# Altium schematic sheet Encoder.SchDoc: Title
size A4; SchTemplateVer: V2.0; Author: Adam Mizerkiewicz; CompanyName: Adam Mizerkiewicz; DrawnBy: Adam Mizerkiewicz; Engineer: Adam Mizerkiewicz; Organization: Adam Mizerkiewicz; Address1: Sarnia 2/19; Address2: 61-058 Poznań; Revision: 0.0
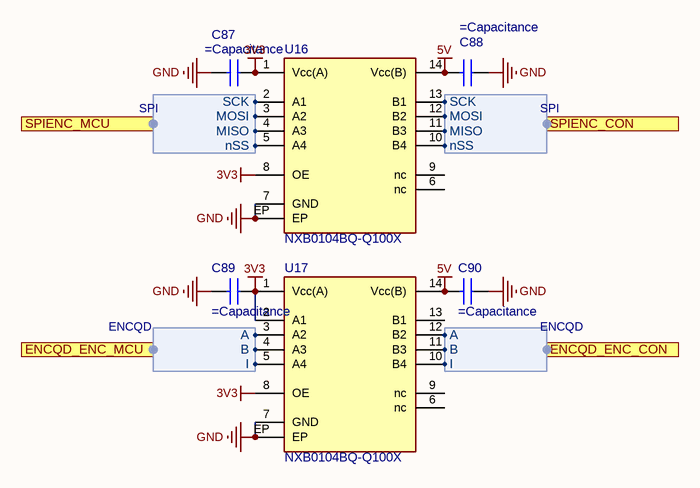
[diagram p0: Encoder.SchDoc]

## Parts
C87  (no value)  [C0402]
C88  (no value)  [C0402]
C89  (no value)  [C0402]
C90  (no value)  [C0402]
U16  NXB0104BQ-Q100X  [DHVQFN14]
U17  NXB0104BQ-Q100X  [DHVQFN14]

## Ports
ENCQD_ENC_CON (harness ENCQD), ENCQD_ENC_MCU (harness ENCQD), SPIENC_CON (harness SPI), SPIENC_MCU (harness SPI)

## Harnesses
SPI: MISO, MOSI, SCK, nSS
ENCQD: B, A, I

## Nets
3V3: C87.1 C89.1 U16.1(Vcc(A)) U16.8(OE) U17.1(Vcc(A)) U17.2(A1) U17.8(OE)
5V: C88.2 C90.2 U16.14(Vcc(B)) U17.14(Vcc(B))
GND: C87.2 C88.1 C89.2 C90.1 U16.7(GND) U16.EP U17.7(GND) U17.EP
NetU16_2: U16.2(A1) ; port SPIENC_MCU.SCK
NetU16_3: U16.3(A2) ; port SPIENC_MCU.MOSI
NetU16_4: U16.4(A3) ; port SPIENC_MCU.MISO
NetU16_5: U16.5(A4) ; port SPIENC_MCU.nSS
NetU16_10: U16.10(B4) ; port SPIENC_CON.nSS
NetU16_11: U16.11(B3) ; port SPIENC_CON.MISO
NetU16_12: U16.12(B2) ; port SPIENC_CON.MOSI
NetU16_13: U16.13(B1) ; port SPIENC_CON.SCK
NetU17_3: U17.3(A2) ; port ENCQD_ENC_MCU.A
NetU17_4: U17.4(A3) ; port ENCQD_ENC_MCU.B
NetU17_5: U17.5(A4) ; port ENCQD_ENC_MCU.I
NetU17_10: U17.10(B4) ; port ENCQD_ENC_CON.I
NetU17_11: U17.11(B3) ; port ENCQD_ENC_CON.B
NetU17_12: U17.12(B2) ; port ENCQD_ENC_CON.A

Not connected (* = marked no-connect by the designer): U16 6(nc) 9(nc); U17 6(nc) 9(nc) 13(B1)

## Notes on the sheet
- Revision
  =Revision
- Sheet
  =SheetNumber / =SheetTotal

## Library data of the parts
C87-C90 = CAP0402-0.1uF-50V: CAP CER 0.1UF 50V X7R 0402; Manufacturer: Walsin Technologies; Manufacturer Part Number: 0402B104K500CT; Capacitance: 100nF; Material: 4241ConductorMaterial; Value: 100nF; Tolerance: 10%; Dielectric: 1511DielectricType; Supplier: Digikey; Supplier Part Number: 1292-1176-1-ND; RoHS: Yes; Category: Ceramic Capacitors; Stock: 109567; Pricing: 1=0,08, 10=0,005, 100=0,0032, 1000=0,0024 (USD); Mounting Technology: Surface Mount; Case/Package: 0402; Case Code (Imperial): 0402; Case Code (Metric): 1005; Min Operating Temperature: -55°C; Max Operating Temperature: 125°C; Packaging: Cut Tape; Voltage Rating: 50V; Series: -; Voltage Rating (DC): 50V; Height: 550um; RoHS Compliant: Yes; Lead Free: 5697LeadFree; ComponentLink1URL: http://datasheet.octopart.com/0402B104K500CT-Walsin-Technologies-datasheet-26371553.pdf?src-supplier=Arrow+Electronics; ComponentLink1Description: http://datasheet.octopart.com/0402B104K500CT-Walsin-Technologies-datasheet-26371553.pdf?src-supplier=Arrow+Electronics; ComponentLink2URL: http://datasheet.octopart.com/0402B104K500CT-Walsin-Technologies-datasheet-26371553.pdf?src-supplier=Verical; ComponentLink2Description: http://datasheet.octopart.com/0402B104K500CT-Walsin-Technologies-datasheet-26371553.pdf?src-supplier=Verical; ComponentLink3URL: http://www.passivecomponent.com/indexsea/0402B104K500CT-IE.pdf?src-supplier=Digikey; ComponentLink3Description: http://www.passivecomponent.com/indexsea/0402B104K500CT-IE.pdf?src-supplier=Digikey; ComponentLink4URL: http://datasheet.octopart.com/0402B104K500CT-Walsin-Technologies-datasheet-26371553.pdf?src-supplier=Rs; ComponentLink4Description: http://datasheet.octopart.com/0402B104K500CT-Walsin-Technologies-datasheet-26371553.pdf?src-supplier=Rs; ComponentLink5URL: https://datasheet.octopart.com/0402B104K500CT-Walsin-Technologies-datasheet-128065749.pdf?src-supplier=Future+Electronics; ComponentLink5Description: https://datasheet.octopart.com/0402B104K500CT-Walsin-Technologies-datasheet-128065749.pdf?src-supplier=Future+Electronics; ComponentLink6URL: http://datasheet.octopart.com/0402B104K500CT-Walsin-Technologies-datasheet-26371553.pdf?src-supplier=Farnell; ComponentLink6Description: http://datasheet.octopart.com/0402B104K500CT-Walsin-Technologies-datasheet-26371553.pdf?src-supplier=Farnell; ComponentLink7URL: http://datasheet.octopart.com/0402B104K500CT-Walsin-Technologies-datasheet-26371553.pdf?src-supplier=Newark; ComponentLink7Description: http://datasheet.octopart.com/0402B104K500CT-Walsin-Technologies-datasheet-26371553.pdf?src-supplier=Newark; ComponentLink8URL: http://datasheet.octopart.com/0402B104K500CT-Walsin-Technologies-datasheet-26371553.pdf?src-supplier=Mouser; ComponentLink8Description: http://datasheet.octopart.com/0402B104K500CT-Walsin-Technologies-datasheet-26371553.pdf?src-supplier=Mouser; ComponentLink9URL: http://datasheet.octopart.com/0402B104K500CT-Walsin-Technologies-datasheet-26371553.pdf?src-supplier=Digikey; ComponentLink9Description: http://datasheet.octopart.com/0402B104K500CT-Walsin-Technologies-datasheet-26371553.pdf?src-supplier=Digikey; ComponentLink10URL: https://datasheet.octopart.com/0402B104K500CT-Walsin-Technologies-datasheet-62066062.pdf?src-supplier=TME; ComponentLink10Description: https://datasheet.octopart.com/0402B104K500CT-Walsin-Technologies-datasheet-62066062.pdf?src-supplier=TME; ComponentLink11URL: http://datasheet.octopart.com/0402B104K500CT-Walsin-Technologies-datasheet-26371553.pdf?src-supplier=Freelance+Electronics; ComponentLink11Description: http://datasheet.octopart.com/0402B104K500CT-Walsin-Technologies-datasheet-26371553.pdf?src-supplier=Freelance+Electronics; ComponentLink12URL: http://datasheet.octopart.com/0402B104K500CT-Walsin-Technologies-datasheet-26371553.pdf?src-supplier=Component+Sense; ComponentLink12Description: http://datasheet.octopart.com/0402B104K500CT-Walsin-Technologies-datasheet-26371553.pdf?src-supplier=Component+Sense; ComponentLink13URL: http://datasheet.octopart.com/0402B104K500CT-Walsin-Technologies-datasheet-26371553.pdf?src-supplier=NAC+Semi; ComponentLink13Description: http://datasheet.octopart.com/0402B104K500CT-Walsin-Technologies-datasheet-26371553.pdf?src-supplier=NAC+Semi; ComponentLink14URL: https://datasheet.octopart.com/0402B104K500CT-Walsin-Technologies-datasheet-136037192.pdf?src-supplier=TECHDesign; ComponentLink14Description: https://datasheet.octopart.com/0402B104K500CT-Walsin-Technologies-datasheet-136037192.pdf?src-supplier=TECHDesign; Supplier 1: Digikey; Supplier Part Number 1: 1292-1176-1-ND
U16 U17 = NXB0104BQ-Q100: 1.65V~5.5V 1 2 1.2V~3.6V 100Mbps DHVQFN-14-EP(2.5x3) Translators / Level Shifters ROHS; Manufacturer: Nexperia; Manufacturer Lifecycle Status: RELEASED FOR SUPPLY; Supplier: DigiKey; Supplier Part Number: 1727-NXB0104BQ-Q100XCT-ND; Manufacturer Part Number: NXB0104BQ-Q100X; RoHS: Compliant; Category: Voltage Level Shifters; Stock: 3106; Pricing: 1=0,73, 10=0,517, 25=0,4648, 100=0,4068, 250=0,3792, 500=0,36258, 1000=0,35771 (USD); Lifecycle Status: Production; ComponentLink1URL: https://datasheet.octopart.com:443/NXB0104BQ-Q100X-Nexperia-datasheet-137152397.pdf?src-supplier=Future+Electronics; ComponentLink1Description: https://datasheet.octopart.com:443/NXB0104BQ-Q100X-Nexperia-datasheet-137152397.pdf?src-supplier=Future+Electronics; Supplier 1: DigiKey; Supplier Part Number 1: 1727-NXB0104BQ-Q100XCT-ND